# Altium schematic sheet loom-accumulator.SchDoc
size 594 x 420 mm
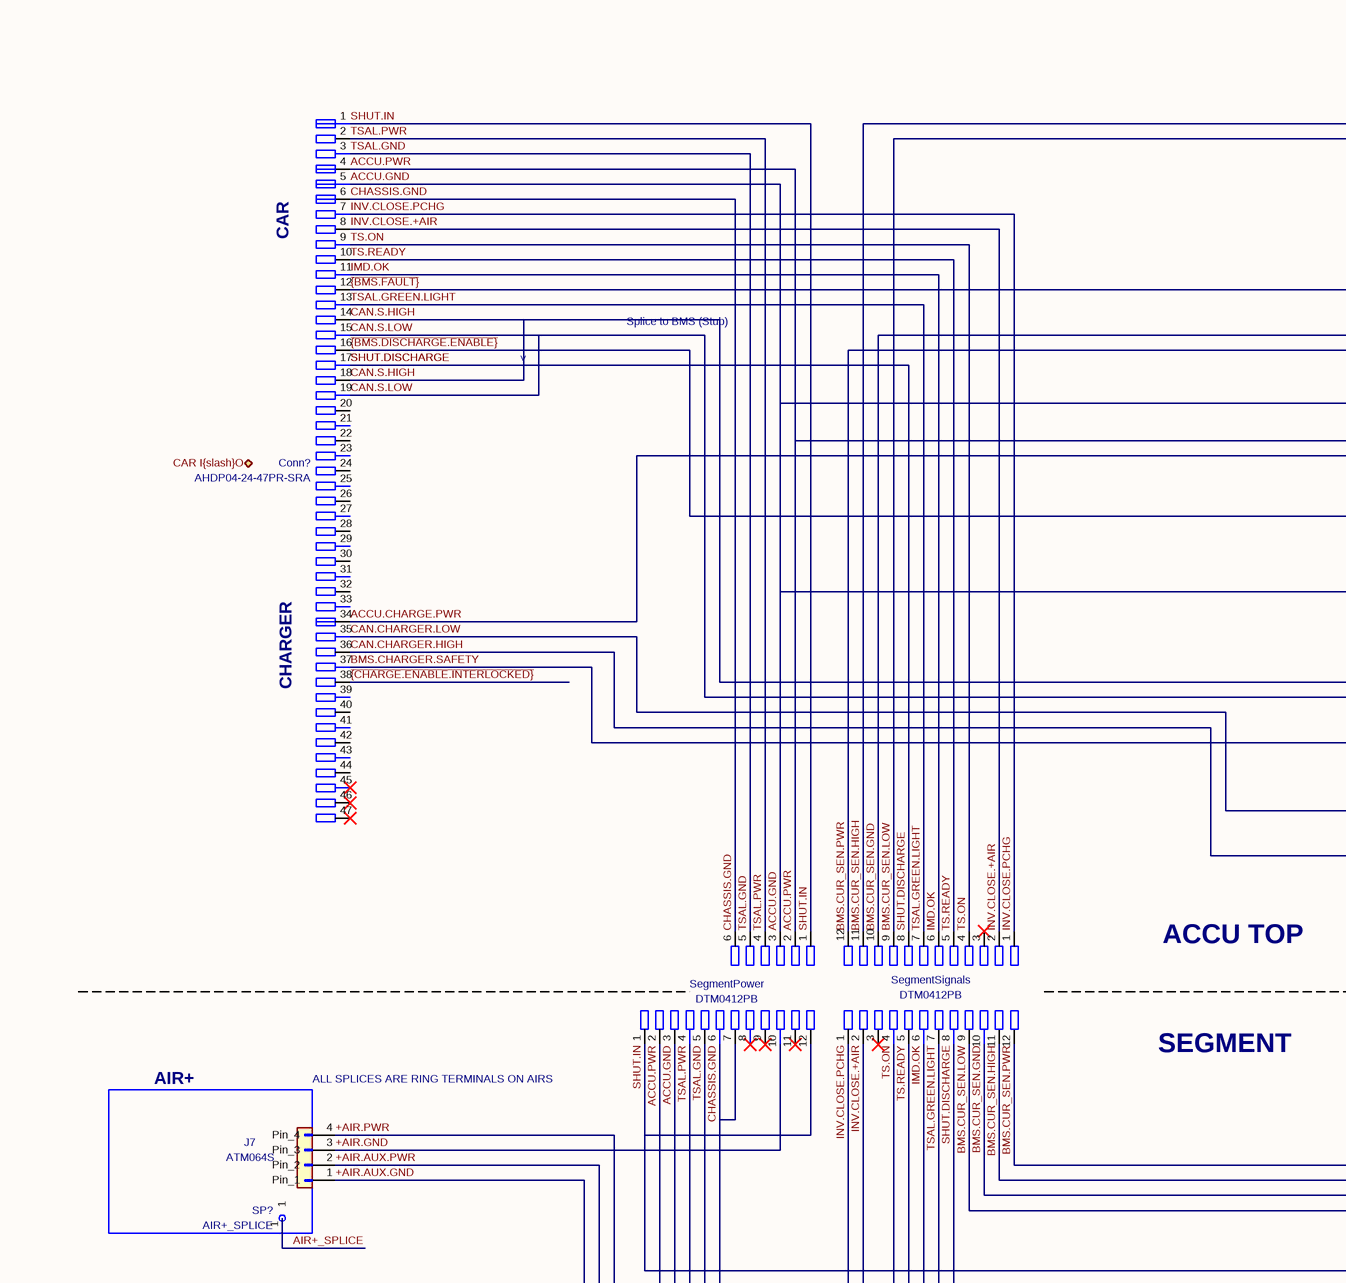
[diagram p0: loom-accumulator.SchDoc, top left]
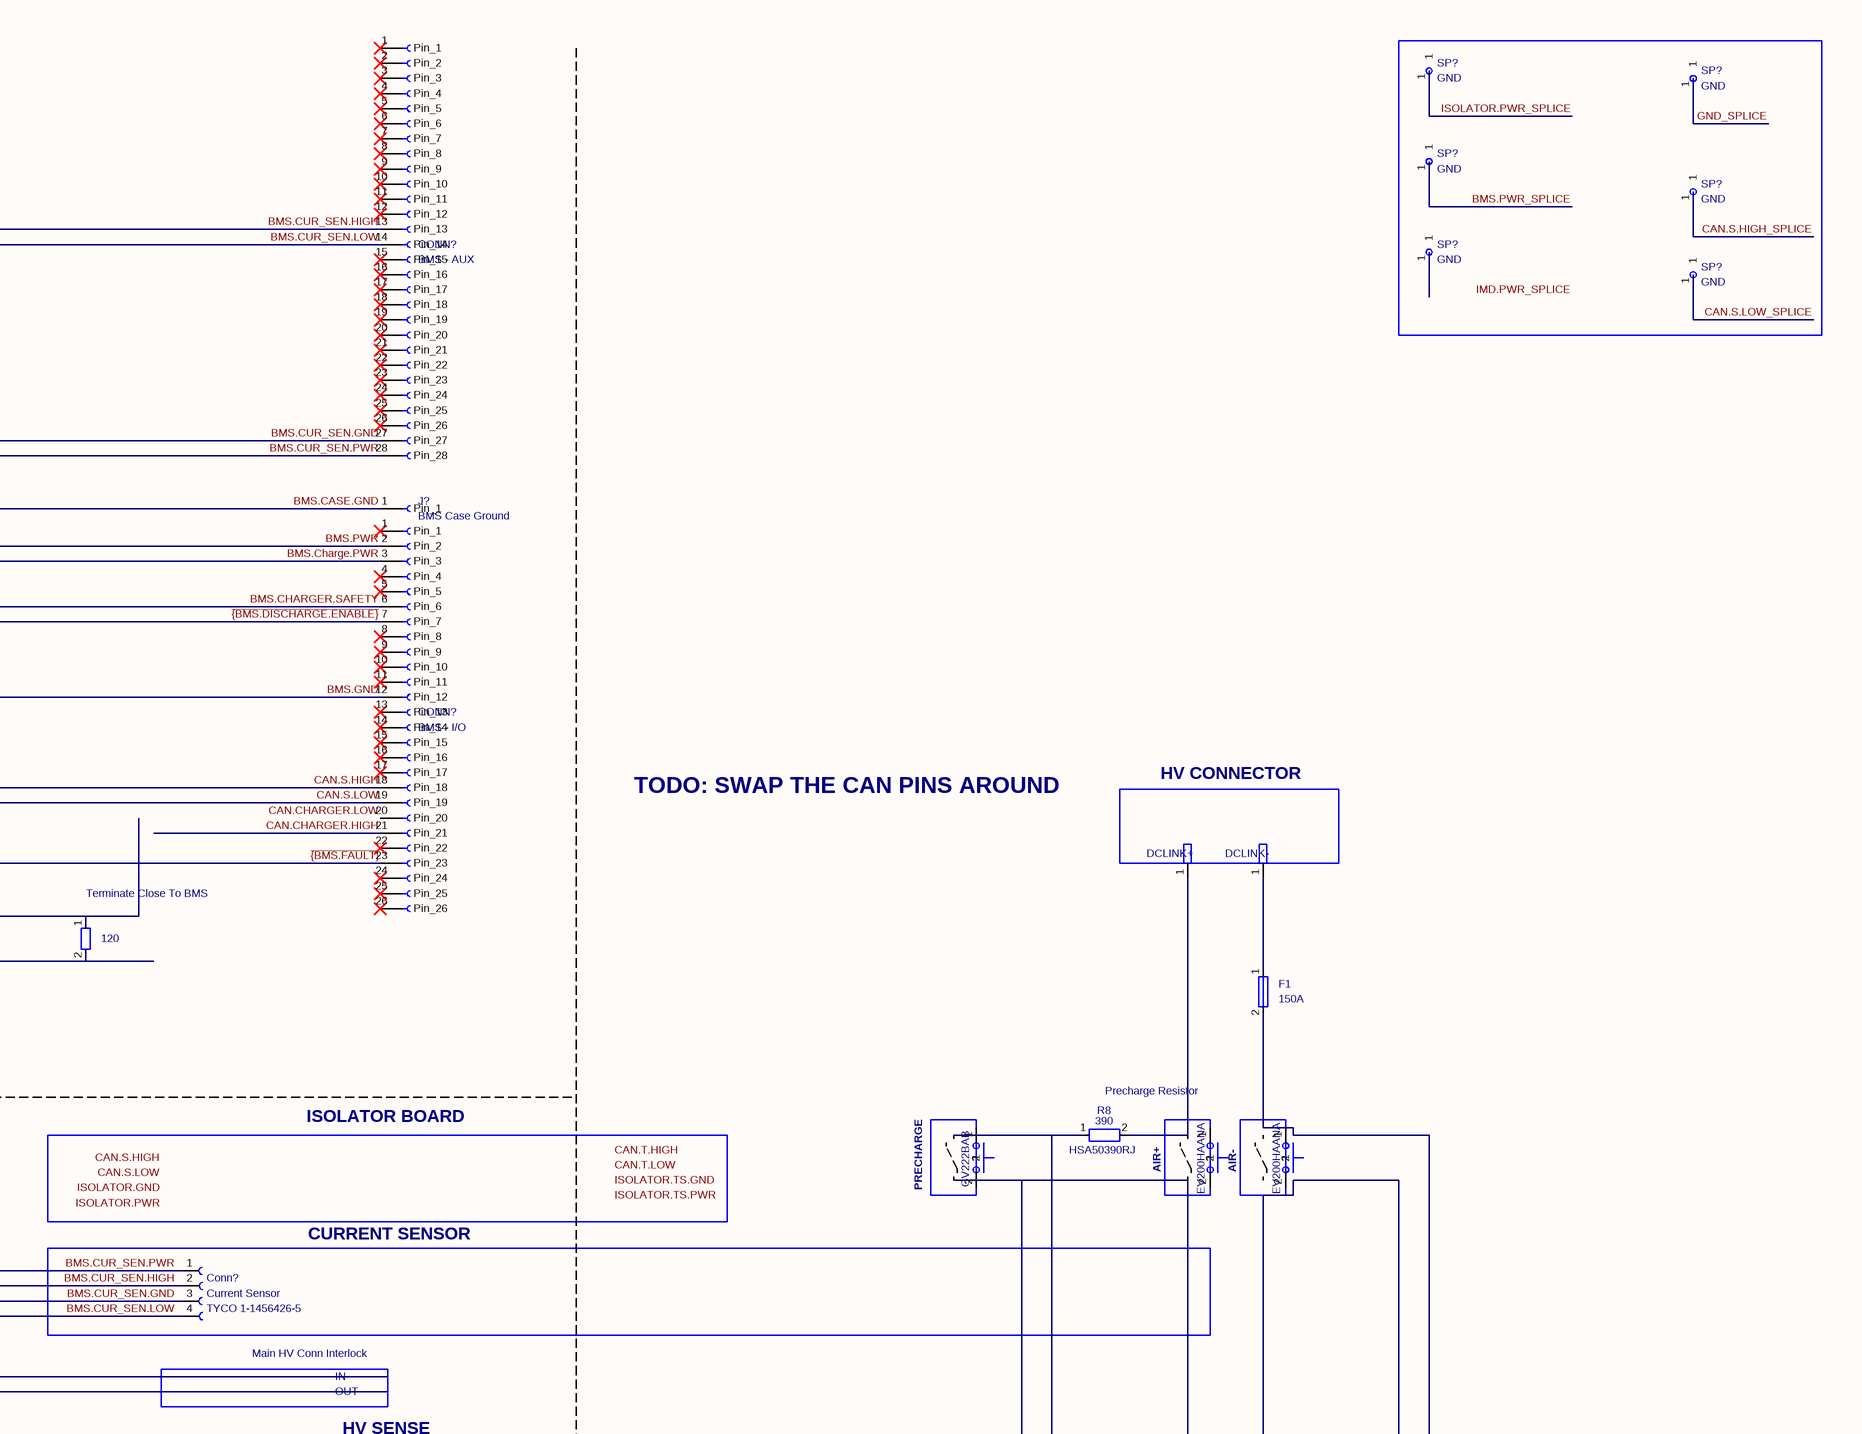
[diagram p1: loom-accumulator.SchDoc, top right]
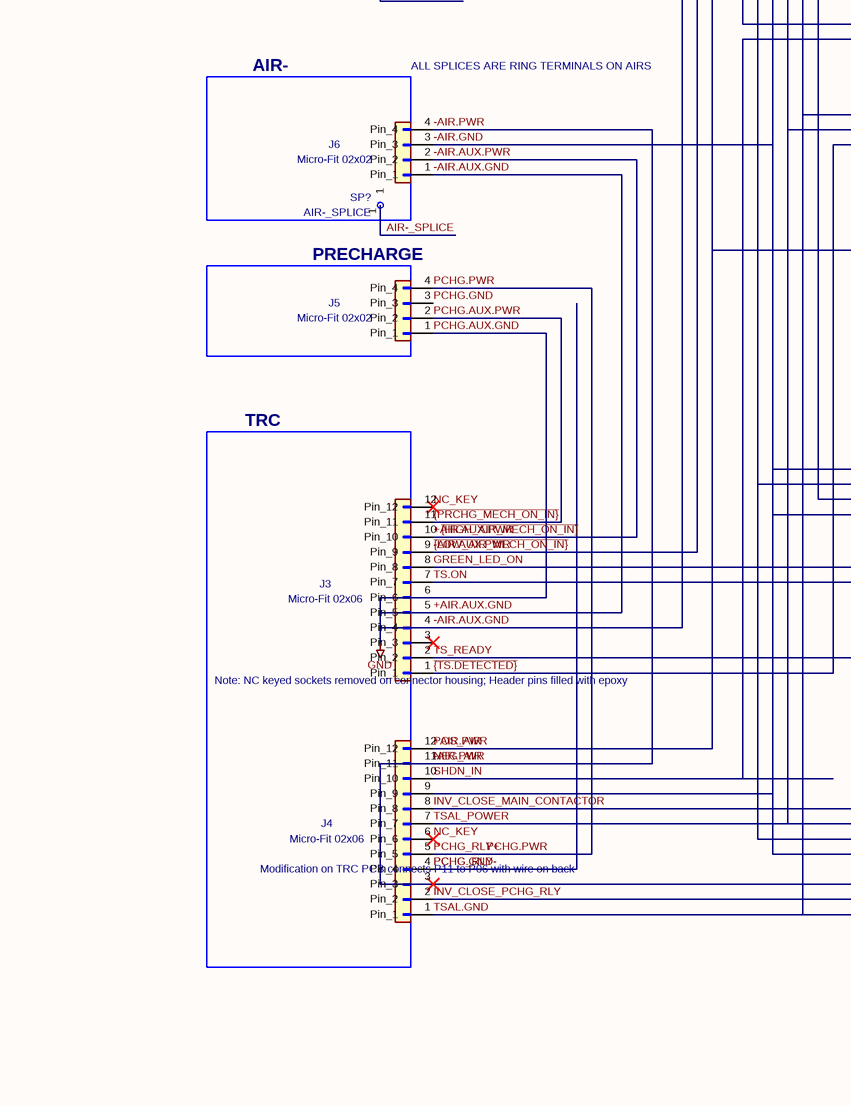
[diagram p2: loom-accumulator.SchDoc, bottom left]
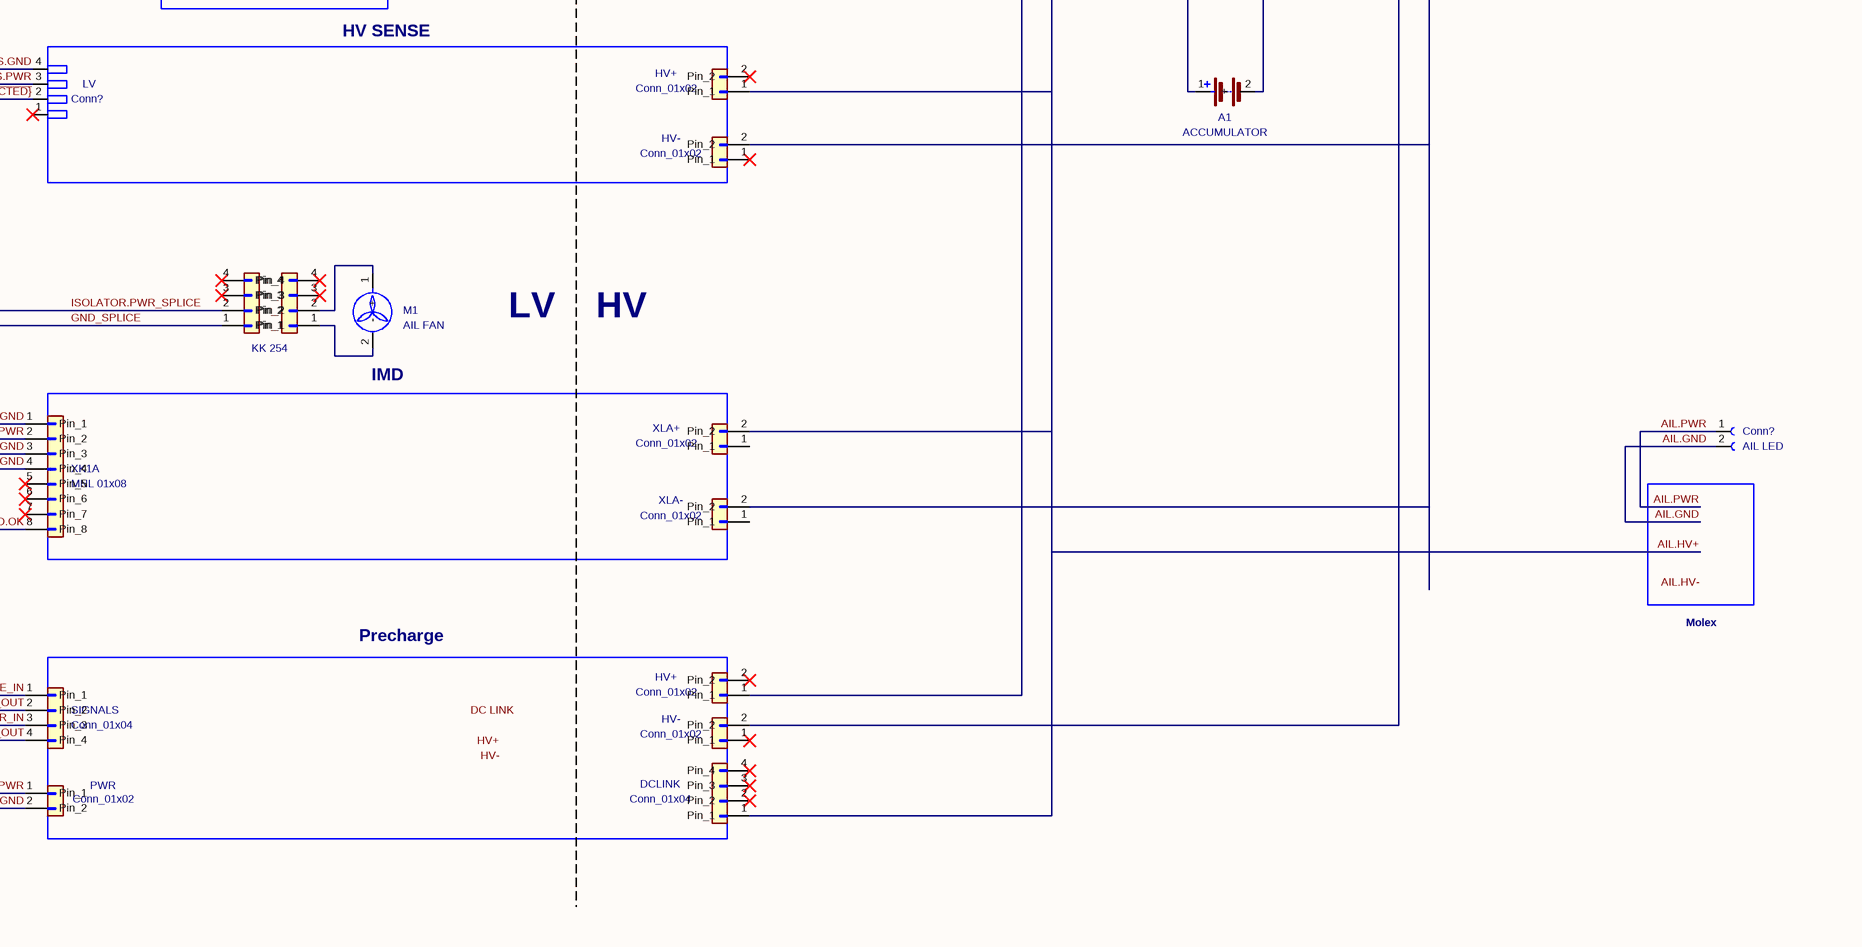
[diagram p3: loom-accumulator.SchDoc, bottom right]

## Parts
(Parts that share a designator on the sheet are numbered #1, #2 ... from top to bottom, then left to right.)
A1  ACCUMULATOR
Conn2  P/N: KK 254  (hidden comment: AIL FAN)
Conn9  Connection Type: DCLINK-  (hidden comment: Banana Plug)
Conn54  AIL FAN  (value not drawn)
Conn?#1  P/N: AHDP04-24-47PR-SRA  (hidden comment: AMPHENOL-47P-Pannel)
CONN?#2  BMS - AUX
CONN?#3  BMS - I/O
Conn?#4  P/N: TYCO 1-1456426-5  (hidden comment: Current Sensor)
Conn?#5  Name: LV  (hidden comment: ~)
Conn?#6  AIL LED
DCLINK  Conn_01x04
DCLINK+  Connection Type: DCLINK+  (hidden comment: Banana Plug)
F1  150A
HV+#1  Conn_01x02
HV+#2  Conn_01x02
HV-#1  Conn_01x02
HV-#2  Conn_01x02
J3  Micro-Fit 02x06
J4  Micro-Fit 02x06
J5  Micro-Fit 02x02
J6  Micro-Fit 02x02
J7  ATM064S
J?  BMS Case Ground
M1  AIL FAN
PWR  Conn_01x02
R1  120
R8  390  [HSA50390RJ]
SegmentPower  P/N: DTM0412PB  (hidden comment: Deutsch_DTM_12P_Pin)
SegmentPower1  Deutsch_DTM_6P_Pin  (value not drawn)
SegmentSignals  P/N: DTM0412PB  (hidden comment: Deutsch_DTM_12P_Pin)
SegmentSignals1  Deutsch_DTM_12P_Pin  (value not drawn)
SIGNALS  Conn_01x04
SP?#1  GND
SP?#2  GND
SP?#3  GND
SP?#4  GND
SP?#5  GND
SP?#6  GND
SP?#7  AIR+_SPLICE
SP?#8  AIR-_SPLICE
SW7  EV200HAANA
SW8  EV200HAANA
SW9  GV222BAB
XK1A  MNL 01x08
XLA+  Conn_01x02
XLA-  Conn_01x02

## Blocks framed on the sheet
HV CONNECTOR /: Conn9 DCLINK+
AIR+: SP?#7
CURRENT SENSOR /: Conn?#4
AIR-: SP?#8
HV SENSE: Conn?#5
IMD: XK1A
Precharge: PWR SIGNALS

## Ports
CAR I{slash}O (bidir)

## Nets
+AIR.AUX.GND: J3.4(Pin_4) J3.5(Pin_5) J3.6(Pin_6) J5.1(Pin_1) J6.1(Pin_1) J7.1(Pin_1)  [also labelled -AIR.AUX.GND, GND, PCHG.AUX.GND]
+AIR.AUX.PWR: J3.9(Pin_9) J3.10(Pin_10) J6.2(Pin_2) J7.2(Pin_2)  [also labelled -AIR.AUX.PWR, ~{{HIGH_AIR_MECH_ON_IN}}, ~{{LOW_AIR_MECH_ON_IN}}]
+AIR.GND: Conn2.1(Pin_1) Conn?#1.5 CONN?#3.12(Pin_12) J4.9(Pin_9) J6.3(Pin_3) J7.3(Pin_3) J?.1(Pin_1) PWR.2(Pin_2) SegmentPower.3 SegmentPower.10 SegmentPower1.3 SP?#2.1 XK1A.1(Pin_1) XK1A.4(Pin_4)  [also labelled -AIR.GND, ACCU.GND, BMS.CASE.GND, BMS.GND, GND_SPLICE, IMD.GND, PRECHARGE.GND]
+AIR.PWR: Conn?#1.17 J4.3(Pin_3) J4.11(Pin_11) J4.12(Pin_12) J6.4(Pin_4) J7.4(Pin_4) SegmentSignals.8 SegmentSignals1.8  [also labelled -AIR.PWR, NEG_AIR, POS_AIR, SHUT.DISCHARGE]
ACCU.CHARGE.PWR: Conn?#1.34 CONN?#3.3(Pin_3)  [also labelled BMS.Charge.PWR]
ACCU.PWR: Conn2.2(Pin_2) Conn?#1.4 CONN?#3.2(Pin_2) PWR.1(Pin_1) SegmentPower.2 SegmentPower1.2 SP?#1.1 XK1A.2(Pin_2)  [also labelled BMS.PWR, IMD.PWR, ISOLATOR.PWR_SPLICE, PRECHARGE.PWR]
AIL.GND: Conn?#6.2
AIL.HV+: DCLINK.1(Pin_1) HV+#1.1(Pin_1) R8.1 XLA+.2(Pin_2)
AIL.PWR: Conn?#6.1
AIR+_SPLICE: SP?#7.1
AIR-_SPLICE: SP?#8.1
BMS.CHARGER.SAFETY: Conn?#1.37 CONN?#3.6(Pin_6)
BMS.CUR_SEN.GND: CONN?#2.27(Pin_27) Conn?#4.3 SegmentSignals.10 SegmentSignals1.10
BMS.CUR_SEN.HIGH: CONN?#2.13(Pin_13) Conn?#4.2 SegmentSignals.11 SegmentSignals1.11
BMS.CUR_SEN.LOW: CONN?#2.14(Pin_14) Conn?#4.4 SegmentSignals.9 SegmentSignals1.9
BMS.CUR_SEN.PWR: CONN?#2.28(Pin_28) Conn?#4.1 SegmentSignals.12 SegmentSignals1.12
BMS.PWR_SPLICE: SP?#3.1
CAN.CHARGER.HIGH: Conn?#1.36 CONN?#3.21(Pin_21) R1.2
CAN.CHARGER.LOW: Conn?#1.35 CONN?#3.20(Pin_20) R1.1
CAN.S.HIGH: Conn?#1.14 Conn?#1.18 CONN?#3.18(Pin_18)
CAN.S.HIGH_SPLICE: SP?#4.1
CAN.S.LOW: Conn?#1.15 Conn?#1.19 CONN?#3.19(Pin_19)
CAN.S.LOW_SPLICE: SP?#6.1
CHASSIS.GND: Conn?#1.6 SegmentPower.6 SegmentPower.7 SegmentPower1.6 XK1A.3(Pin_3)
CLOSE_HIGH_AIR_IN: Conn?#1.8 SegmentSignals.2 SegmentSignals1.2 SIGNALS.3(Pin_3)  [also labelled INV.CLOSE.+AIR]
CLOSE_HIGH_AIR_OUT: J4.8(Pin_8) SIGNALS.4(Pin_4)  [also labelled INV_CLOSE_MAIN_CONTACTOR]
CLOSE_PRECHARGE_IN: Conn?#1.7 J4.2(Pin_2) SegmentSignals.1 SegmentSignals1.1 SIGNALS.1(Pin_1) SIGNALS.2(Pin_2)  [also labelled CLOSE_PRECHARGE_OUT, INV.CLOSE.PCHG, INV_CLOSE_PCHG_RLY]
GREEN_LED_ON: Conn?#1.13 J3.8(Pin_8) SegmentSignals.7 SegmentSignals1.7  [also labelled TSAL.GREEN.LIGHT]
IMD.OK: Conn?#1.11 SegmentSignals.6 SegmentSignals1.6 XK1A.8(Pin_8)
NC_KEY: J3.12(Pin_12) J4.6(Pin_6)
PCHG.AUX.PWR: J3.11(Pin_11) J5.2(Pin_2)  [also labelled ~{{PRCHG_MECH_ON_IN}}]
PCHG.GND: J4.4(Pin_4) J5.3(Pin_3)  [also labelled PCHG_RLY-]
PCHG.PWR: J4.5(Pin_5) J5.4(Pin_4)  [also labelled PCHG_RLY+]
SHDN_IN: J4.10(Pin_10)
SHUT.IN: Conn?#1.1 SegmentPower.1 SegmentPower.12 SegmentPower1.1
TS.ON: Conn?#1.9 J3.7(Pin_7) SegmentSignals.4 SegmentSignals1.4
TS.READY: Conn?#1.10 J3.2(Pin_2) SegmentSignals.5 SegmentSignals1.5  [also labelled TS_READY]
TSAC.HVS.GND: Conn?#1.3 Conn?#5.4 J4.1(Pin_1) SegmentPower.5 SegmentPower1.5  [also labelled TSAL.GND]
TSAC.HVS.PWR: Conn?#1.2 Conn?#5.3 J4.7(Pin_7) SegmentPower.4 SegmentPower1.4  [also labelled TSAL.PWR, TSAL_POWER]
~{{BMS.DISCHARGE.ENABLE}}: Conn?#1.16 CONN?#3.7(Pin_7)
~{{BMS.FAULT}}: Conn?#1.12 CONN?#3.23(Pin_23)
~{{CHARGE.ENABLE.INTERLOCKED}}: Conn?#1.38
~{{TS.DETECTED}}: Conn?#5.2 J3.1(Pin_1)
NetA1_1: A1.1(+) HV+#2.1(Pin_1)
NetA1_2: A1.2(-) HV-#2.2(Pin_2)
NetConn9_1: Conn9.1 F1.1
NetConn54_1: Conn54.1(Pin_1) M1.2(-)
NetConn54_2: Conn54.2(Pin_2) M1.1(+)
NetDCLINK+_1: DCLINK+.1 R8.2
NetF1_2: F1.2 HV-#1.2(Pin_2) SW8.1 XLA-.2(Pin_2)

Not connected (* = marked no-connect by the designer): Conn2 3(Pin_3)* 4(Pin_4)*; Conn54 3(Pin_3)* 4(Pin_4)*; Conn?#1 20 21 22 23 24 25 26 27 28 29 30 31 32 33 39 40 41 42 43 44 45* 46* 47*; CONN?#2 1(Pin_1)* 2(Pin_2)* 3(Pin_3)* 4(Pin_4)* 5(Pin_5)* 6(Pin_6)* 7(Pin_7)* 8(Pin_8)* 9(Pin_9)* 10(Pin_10)* 11(Pin_11)* 12(Pin_12)* 15(Pin_15)* 16(Pin_16)* 17(Pin_17)* 18(Pin_18)* 19(Pin_19)* 20(Pin_20)* 21(Pin_21)* 22(Pin_22)* 23(Pin_23)* 24(Pin_24)* 25(Pin_25)* 26(Pin_26)*; CONN?#3 1(Pin_1)* 4(Pin_4)* 5(Pin_5)* 8(Pin_8)* 9(Pin_9)* 10(Pin_10)* 11(Pin_11)* 13(Pin_13)* 14(Pin_14)* 15(Pin_15)* 16(Pin_16)* 17(Pin_17)* 22(Pin_22)* 24(Pin_24)* 25(Pin_25)* 26(Pin_26)*; Conn?#5 1*; DCLINK 2(Pin_2)* 3(Pin_3)* 4(Pin_4)*; HV+#1 2(Pin_2)*; HV+#2 2(Pin_2)*; HV-#1 1(Pin_1)*; HV-#2 1(Pin_1)*; J3 3(Pin_3)*; SegmentPower 8* 9* 11*; SegmentSignals 3*; SegmentSignals1 3*; SP?#5 1; SW7 1 2; SW8 2; SW9 1 2; XK1A 5(Pin_5)* 6(Pin_6)* 7(Pin_7)*; XLA+ 1(Pin_1); XLA- 1(Pin_1)

## Notes on the sheet
- (near Conn?#1) CAR
- <--
- Splice to BMS (Stub)
- (near Conn?#1) CHARGER
- TODO: SWAP THE CAN PINS AROUND
- (near R1) Terminate Close
  To BMS
- ACCU TOP
- SEGMENT
- ISOLATOR BOARD
- Precharge Resistor
- (near J7) ALL SPLICES ARE RING
  TERMINALS ON AIRS
- (near SW9) PRECHARGE
- AIR+
- (near SW7) AIR-
- Main HV Conn Interlock
- IN
- OUT
- (near J6) ALL SPLICES ARE RING
  TERMINALS ON AIRS
- PRECHARGE
- LV
- HV
- TRC
- (near J3) Note: NC keyed sockets
  removed on connector housing;
  Header pins filled with epoxy
- Molex
- (near J4) Modification on
  TRC PCB connects
  P11 to P06 with
  wire on back
- Labels drawn without touching a wire or pin: AIL.HV-, CAN.S.HIGH, CAN.S.LOW, CAN.T.HIGH, CAN.T.LOW, DC LINK, HV+, HV-, IMD.PWR_SPLICE, ISOLATOR.GND, ISOLATOR.PWR, ISOLATOR.TS.GND, ISOLATOR.TS.PWR
- 1
- 2
- 3
- 4
- 5
- 6
- 7
- 8
- 9
- 10
- 11
- A
- B
- C
- D
- E
- F
- G
- H
- Title: LOOM - ACCUMULATOR
- File: loom-accumulator.kicad_sch
- Sheet: /
- KiCad E.D.A.  kicad (5.1.4)-1
- Size: A2
- Date:
- Rev:
- Id: 1/1

## Library data of the parts
A1 = Battery: Description: Multiple-cell battery; Value: ACCUMULATOR
Conn2 DCLINK J5-J7 SIGNALS = Conn_01x04: Description: Generic connector, single row, 01x04, script generated (kicad-library-utils/schlib/autogen/connector/)
  Conn2: Value: AIL FAN
  DCLINK SIGNALS: Value: Conn_01x04
  J5 J6: Value: Micro-Fit 02x02
  J7: Value: ATM064S
Conn54 = Conn_01x04: Description: Generic connector, single row, 01x04, script generated (kicad-library-utils/schlib/autogen/connector/); P/N: KK 254; Value: AIL FAN
CONN?#2 = Conn_01x28_Socket: Value: BMS - AUX
CONN?#3 = Conn_01x26_Socket: Value: BMS - I/O
Conn?#4 = Current Sensor Connector: Value: Current Sensor
Conn?#5 = Molex_2x2P_Horizontal_1: P/N: 43045-0400; Value: ~
Conn?#6 = Molex_2x1S_Recepticle: P/N: 43645-0200; Value: AIL LED
F1 = Fuse: Description: Fuse; Value: 150A
HV+#1 HV+#2 HV-#1 HV-#2 PWR XLA+ XLA- = Conn_01x02: Description: Generic connector, single row, 01x02, script generated (kicad-library-utils/schlib/autogen/connector/); Value: Conn_01x02
J3 J4 = Conn_01x12: Description: Generic connector, single row, 01x12, script generated (kicad-library-utils/schlib/autogen/connector/); Value: Micro-Fit 02x06
J? = Conn_01x01_Socket: Description: Generic connector, single row, 01x01, script generated; Value: BMS Case Ground
M1 = Fan: Description: Fan; Value: AIL FAN
R1 = R_Small: Description: Resistor, small symbol; Value: 120
R8 = R: Description: Resistor; Value: 390
SegmentPower1 = Deutsch_DTM_6P_Pin: P/N: DTM046P-E003; Value: Deutsch_DTM_6P_Pin
SegmentSignals1 = Deutsch_DTM_12P_Pin: P/N: DTM0412PB; Value: Deutsch_DTM_12P_Pin
SP?#1-SP?#8 = TestPoint_Small
  SP?#1-SP?#6: Value: GND
  SP?#7: Value: AIR+_SPLICE
  SP?#8: Value: AIR-_SPLICE
SW7-SW9 = SW_Push: Description: Push button switch, generic, two pins
  SW7 SW8: Value: EV200HAANA
  SW9: Value: GV222BAB
XK1A = Conn_01x08: Description: Generic connector, single row, 01x08, script generated (kicad-library-utils/schlib/autogen/connector/); Value: MNL 01x08
Conn9 DCLINK+ = Banana Plug: Value: Banana Plug
Conn?#1 = AMPHENOL-47P-Pannel: Value: AMPHENOL-47P-Pannel
SegmentPower SegmentSignals = Deutsch_DTM_12P_Pin: Value: Deutsch_DTM_12P_Pin